# Altium schematic sheet STM32_Schematic.SchDoc
size A3; SheetNumber: 1; SheetTotal: 1
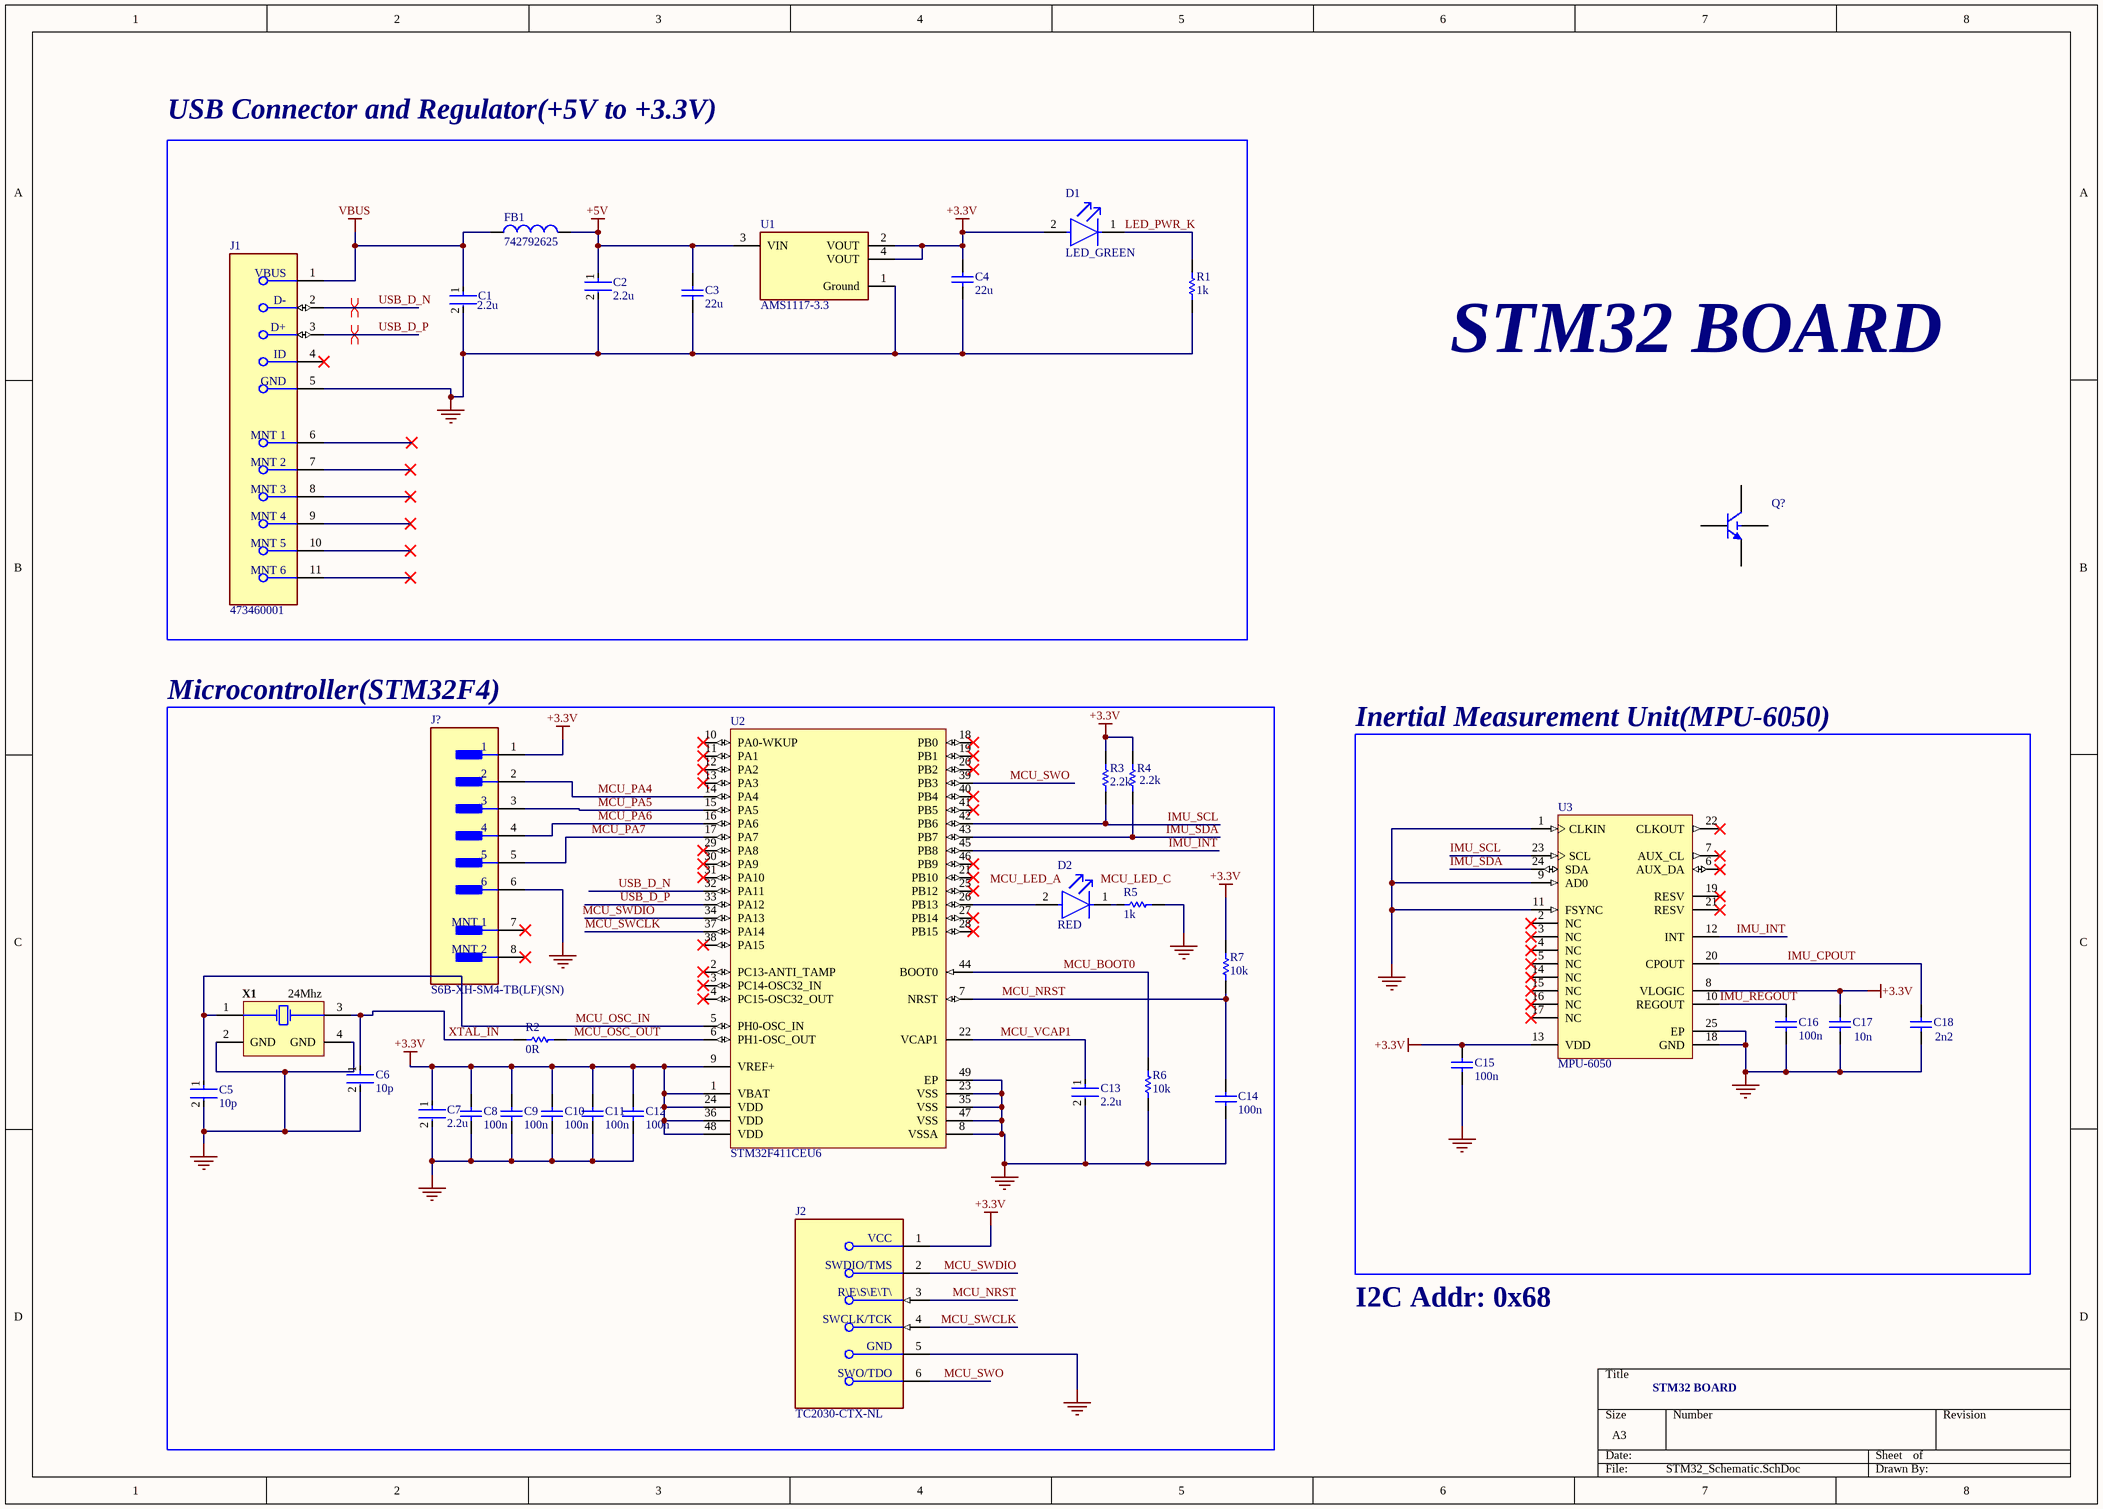
[diagram p0: STM32_Schematic.SchDoc]

## Parts
C1  2.2u  [FP-C0603C225K4PACTU-MFG]
C2  2.2u  [FP-C0603C225K4PACTU-MFG]
C3  22u  [CAPC2013X140X50ML20T25]
C4  22u  [CAPC2013X140X50ML20T25]
C5  10p  [FP-C0402-BB-MFG]
C6  10p  [FP-C0402-BB-MFG]
C7  2.2u  [FP-C0603C225K4PACTU-MFG]
C8  100n  [CAPC1005X55X30LL05T10]
C9  100n  [CAPC1005X55X30LL05T10]
C10  100n  [CAPC1005X55X30LL05T10]
C11  100n  [CAPC1005X55X30LL05T10]
C12  100n  [CAPC1005X55X30LL05T10]
C13  2.2u  [FP-C0603C225K4PACTU-MFG]
C14  100n  [CAPC1005X55X30LL05T10]
C15  100n  [CAPC1005X55X30LL05T10]
C16  100n  [CAPC1005X55X30LL05T10]
C17  10n  [CAPC1005X55X30LL05T10]
C18  2n2  [CAPC1005X55X30LL05T10]
D1  LED_GREEN  [FP-APHHS1005CGCK-MFG]
D2  RED  [FP-SML-P11UTT86-MFG]
FB1  742792625  [WE-CBF_0603_L1.6W0.8H0.8_HC]
J1  473460001  [FP-473460001-MFG]
J2  TC2030-CTX-NL  [FP-TC2030-CTX-NL-MFG]
J?  S6B-XH-SM4-TB(LF)(SN)  [FP-S6B-XH-SM4-TB_LF_SN-MFG]
Q?  Bipolar NPN 4 Pins Transistor Gummel-Poon Model  (value not drawn)
R1  1k  [RESC1005X40X25ML10T10]
R2  0R  [RESC1005X40X25LL10T10]
R3  2.2k  [RESC1005X40X25LL05T05]
R4  2.2k  [RESC1005X40X25LL05T05]
R5  1k  [RESC1005X40X25ML10T10]
R6  10k  [RESC1005X40X25NL10T10]
R7  10k  [RESC1005X40X25NL10T10]
U1  AMS1117-3.3  [FP-AMS1117-IPC_C]
U2  STM32F411CEU6  [STM-UFQFPN48_L]
U3  MPU-6050  [IS-QFN-24_V]
X1  24Mhz  [EPSON-TSX-3225_V]

## Blocks framed on the sheet
USB Connector and Regulator(+5V to +3.3V): C1-C4 D1 FB1 J1 R1 U1
Microcontroller(STM32F4): C5-C14 D2 J2 J? R2-R7 U2 X1
Inertial Measurement Unit(MPU-6050): C15-C18 U3

## Nets
+3.3V: C4.2 C7.1 C8.2 C9.2 C10.2 C11.2 C12.2 C15.2 C17.2 D1.2(A) J2.1(VCC) J?.1 R3.2 R4.2 R7.2 U1.2(VOUT) U1.4(VOUT) U2.1(VBAT) U2.9(VREF+) U2.24(VDD) U2.36(VDD) U2.48(VDD) U3.8(VLOGIC) U3.13(VDD)
+5V: C2.1 C3.2 FB1.2 U1.3(VIN)
GND: C1.2 C2.2 C3.1 C4.1 C5.2 C6.2 C7.2 C8.1 C9.1 C10.1 C11.1 C12.1 C13.2 C14.1 C15.1 C16.1 C17.1 C18.1 J1.5(GND) J2.5(GND) J?.6 R1.1 R5.1 R6.1 U1.1(Ground) U2.8(VSSA) U2.23(VSS) U2.35(VSS) U2.47(VSS) U2.49(EP) U3.1(CLKIN) U3.9(AD0) U3.11(FSYNC) U3.18(GND) U3.25(EP) X1.2(GND) X1.4(GND)
VBUS: C1.1 FB1.1 J1.1(VBUS)
IMU_CPOUT: C18.2 U3.20(CPOUT)
IMU_INT: U2.45(PB8) U3.12(INT)
IMU_REGOUT: C16.2 U3.10(REGOUT)
IMU_SCL: R3.1 U2.42(PB6) U3.23(SCL)
IMU_SDA: R4.1 U2.43(PB7) U3.24(SDA)
LED_PWR_K: D1.1(C) R1.2
MCU_NRST: C14.2 J2.3(~{RESET}) R7.1 U2.7(NRST)
MCU_OSC_IN: C5.1 U2.5(PH0-OSC_IN) X1.1(X1)
MCU_OSC_OUT: R2.2 U2.6(PH1-OSC_OUT)
MCU_PA4: J?.2 U2.14(PA4)
MCU_PA5: J?.3 U2.15(PA5)
MCU_PA6: J?.4 U2.16(PA6)
MCU_PA7: J?.5 U2.17(PA7)
MCU_SWCLK: J2.4(SWCLK/TCK) U2.37(PA14)
MCU_SWDIO: J2.2(SWDIO/TMS) U2.34(PA13)
MCU_SWO: J2.6(SWO/TDO) U2.39(PB3)
MCU_VCAP1: C13.1 U2.22(VCAP1)
USB_D_N: J1.2(D-) U2.32(PA11)
USB_D_P: J1.3(D+) U2.33(PA12)
XTAL_IN: C6.1 R2.1 X1.3(X2)
NetD2_1: D2.1(C) R5.2
NetD2_2: D2.2(A) U2.26(PB13)
NetR6_2: R6.2 U2.44(BOOT0)

Not connected (* = marked no-connect by the designer): J1 4(ID)* 6(MNT_1)* 7(MNT_2)* 8(MNT_3)* 9(MNT_4)* 10(MNT_5)* 11(MNT_6)*; J? 7(MNT_1)* 8(MNT_2)*; Q? 1(C) 2(B) 3(E) 4(S); U2 2(PC13-ANTI_TAMP)* 3(PC14-OSC32_IN)* 4(PC15-OSC32_OUT)* 10(PA0-WKUP)* 11(PA1)* 12(PA2)* 13(PA3)* 18(PB0)* 19(PB1)* 20(PB2)* 21(PB10)* 25(PB12)* 27(PB14)* 28(PB15)* 29(PA8)* 30(PA9)* 31(PA10)* 38(PA15)* 40(PB4)* 41(PB5)* 46(PB9)*; U3 2(NC)* 3(NC)* 4(NC)* 5(NC)* 6(AUX_DA)* 7(AUX_CL)* 14(NC)* 15(NC)* 16(NC)* 17(NC)* 19(RESV)* 21(RESV)* 22(CLKOUT)*

## Layout directives
differential pair; differential pair class DIFF_USB: USB_D_N, USB_D_P

## Notes on the sheet
- STM32 BOARD
- I2C Addr: 0x68
- Labels drawn without touching a wire or pin: MCU_BOOT0, MCU_LED_A, MCU_LED_C

## Library data of the parts
C1 C2 C7 C13 = CMP-2006-02259-2: CAP CER 2.2UF 16V X5R 0603; Dielectric Material: Ceramic; Tolerance: 10%; Dissipation Factor: 5%; Series: C; Voltage Rating (DC): 16V; REACH SVHC: No SVHC; RoHS Compliant: Yes; Number of Pins: 2; Max Operating Temperature: 85°C; Voltage Rating: 16V; Min Operating Temperature: -55°C; Termination: SMD/SMT; Dielectric: X5R; Packaging: Tape and Reel; Contact Plating: Tin; Case Code (Metric): 1608; Height: 0.8mm; Capacitance: 2.2uF; Case/Package: 0603; Width: 0.8mm; Construction: Flat; Depth: 0.8mm; Thickness: 0.034inch; Radiation Hardening: No; Length: 1.6mm; Mount: Surface Mount; Case Code (Imperial): 0603; Voltage: 16V; Package Quantity: 1; Lead Free: Lead Free
C3 C4 = CMP-2007-03313-1: Part Number: C0805X225K4RACTU; Manufacturer: Kemet
C5 C6 = CMP-2008-03443-2: CAP CER 10PF 16V 10% NP0 0402; Manufacturer Part Number: C0402C100K4GACTU; Manufacturer: Kemet; Material: Ceramic; Temperature Characteristic: C0G; Temperature Coefficient: 15%; Tolerance: 0.1; Device Class L2: Capacitors; Temperature Range High: +125°C; Device Class L3: Ceramic Capacitors; Height: 0.55mm; Mouser Description: Multilayer Ceramic Capacitors MLCC - SMD/SMT 16volts 10pF C0G 10%; Temperature Range Low: -55°C; Digikey Description: CAP CER 10PF 16V 10% NP0 0402; Device Class L1: Passive Components; ComponentLink2URL: https://content.kemet.com/datasheets/KEM_C1002_X7R_SMD.pdf; Package: C0402-BB; Automotive: No; Ipc Land Pattern Name: CAPC10050X50; Voltage Rating: 16 V; Category: Cap; Lead Free: Yes; RoHS: TRUE; Temperature: -55°C to +125°C; Capacitance: 10 pF; Value: 10 pF; ComponentLink2Description: Datasheet; Octopart: https://octopart.com/c0402c100k4gactu-kemet-12569135
C8-C12 C14-C18 = CMP-0001-00074-2: Manufacturer: Kemet; Part Number: C0402C104K4RACTU
D1 = CMP-44529-000044-1: LED GREEN CLEAR CHIP SMD; Viewing Angle: 120°; Dominant Wavelength: 570nm; Test Current: 20mA; Luminous Intensity: 50mcd; Forward Voltage: 2.1V; Number of LEDs: 1; Lens Color: Clear; Packaging: Tape and Reel; Max Operating Temperature: 85°C; Illumination Color: Green; Length: 1mm; Mount: Surface Mount; Lens Style: Clear; Color: Green; Number of Pins: 2; Wavelength: 570nm; Case/Package: 0402; Width: 0.5mm; Package Quantity: 2000; Case Code (Metric): 1005; Height: 0.6mm; Lead Free: Lead Free; Case Code (Imperial): 0402; Forward Current: 20mA; Min Operating Temperature: -40°C
D2 = CMP-08952-000028-1: LED RED CLEAR 1006 SMD; Number of LEDs: 1; Lens Color: Colorless; Viewing Angle: 150°; Dominant Wavelength: 621nm; Luminous Intensity: 5.5mcd; Forward Voltage: 1.8V; Lens Style: Square; Test Current: 1mA; Forward Current: 20mA; Height: 0.25mm; Radiation Hardening: No; Color: Red; Case Code (Metric): 1005; Number of Pins: 2; RoHS Compliant: Yes; Max Operating Temperature: 85°C; Package Quantity: 1; Wavelength: 621nm; Lens Transparency: Clear; Packaging: Tape and Reel; Lead Free: Lead Free; Illumination Color: Red; Case/Package: 0402; Case Code (Imperial): 0402; Mount: Surface Mount; Min Operating Temperature: -40°C; Width: 0.6mm; Length: 1mm; Series: PicoLED™; REACH SVHC: No SVHC
FB1 = CMP-0220-00174-3: NexarPartId: 30515504; Series Resistance: 50mΩ; Number of Lines: 1; Max Current Rating: 2A; Current Rating: 1.5A; Tolerance: 25%; Impedance: 120Ω; Test Frequency: 400MHz; Mount: Surface Mount; Weight: 2.012816mg; Case Code (Imperial): 0603; Termination: SMD/SMT; RMS Current (Irms): 2A; Width: 800µm; Min Operating Temperature: -55°C; Max Operating Temperature: 125°C; DC Resistance (DCR): 50mΩ; Packaging: Digi-Reel®; Case Code (Metric): 1608; Length: 1.6mm; Case/Package: 0603; Material: Ferrite; RoHS: Compliant; Core Material: Ferrite; Height: 800µm; Max DC Current: 2A; Depth: 800µm
J1 = CMP-2000-05246-2: CONN RCPT USB2.0 MICRO B SMD R/A; Manufacturer: Molex; Conn Orientation: Right Angle; Is Female: yes; Shielding: true; Pitch: 0.65mm; Number Of Contacts: 5; Voltage Rating: 30V; Current Rating: 1.8A; Device Class L2: USB Connectors; Digikey Description: CONN RCPT USB2.0 MICRO B SMD R/A; Height: 2.945mm; RoHS: TRUE; ComponentLink2Description: Datasheet; Octopart: https://octopart.com/47346-0001-molex-7164928; Automotive: No; Package: 0; Category: Conn; Device Class L1: Connectors; Usb Standard: USB 2.0; Temperature: -30°C to +85°C; Temperature Range Low: -30°C; Footprint Url: https://www.molex.com/pdm_docs/sd/473460001_sd.pdf; ComponentLink2URL: https://www.molex.com/webdocs/datasheets/pdf/en-us/0473460001_IO_CONNECTORS.pdf; Lead Free: Yes; Manufacturer Part Number: 473460001; Contact Material: Gold,Nickel; Temperature Range High: +85°C; Device Class L3: unset
J2 = CMP-205963-000001-1: 6-Pin “No legs” TC2030 Plug-of-Nails™ Cable for use with ARM Cortex processors
J? = CMP-17439-000164-1: CONN HEADER SMD R/A 6POS 2.5MM; Gender: Male; Number of Positions: 6; Max Current Rating: 3A; Voltage Rating: 250V; Contact Resistance: 20mR; Flammability Rating: UL94 V-0; Orientation: Right Angle; Contact Finish - Mating: TIN; Packaging: Tape and Reel; Termination: Solder; Pitch: 2.5mm; Housing Color: Beige; Insulation Material: Nylon; Fastening Type: Detent; Housing Material: Polyamide; Package Quantity: 1; Mount: Surface Mount; Insulation Color: Natural; Series: XH; Depth: 7mm; Contact Shape: Square; Color: Natural; Max Voltage Rating (AC): 250V; Min Operating Temperature: -25°C; Number of Contacts: 6; Lead Free: Lead Free; Contact Material: Copper Alloy; Contact Type: Male Pin; Length: 20mm; Max Operating Temperature: 85°C; Connector Type: Header; Number of Rows: 1; REACH SVHC: No SVHC; Contact Plating: Copper
Q? = BJT NPN 4 GP: SimulationGenericComponent: True; BF: 100; AF: 0; BR: 1; EG: 1.11; FC: 0.5; IS: 1e-16; MJC: 0.33; NC: 2; NE: 1.5; TNOM: 27; VBC_MAX: 1e99; VJC: 0.75; XTI: 3; CJC: 0; CJE: 0; CJS: 0; CTC: 0; CTE: 0; CTS: 0; IKF: 0; IKR: 0; IRB: 0; ISC: 0; ISE: 0; ISS: 0; ITF: 0; KF: 0; MJE: 0.33; MJS: 0; NF: 1; NKF: 0.5; NR: 1; NS: 1; PTF: 0; RB: 0; RBM: 0; RC: 0; RE: 0; SUBS: 1; TBF1: 0; TBF2: 0; TBR1: 0; TBR2: 0; TF: 0; TIKF1: 0; TIKF2: 0; TIKR1: 0; TIKR2: 0; TIRB1: 0; TIRB2: 0; TIS1: 0; TIS2: 0; TISC1: 0; TISC2: 0; TISE1: 0; TISE2: 0; TITF1: 0; TITF2: 0; TLEV: 0; TLEVC: 0; TMJC1: 0; TMJC2: 0; TMJE1: 0; TMJE2: 0; TMJS1: 0; TMJS2: 0; TNC1: 0; TNC2: 0; TNE1: 0; TNE2: 0; TNF1: 0; TNF2: 0; TNR1: 0; TNR2: 0; TNS1: 0; TNS2: 0; TR: 0; TRB1: 0; TRB2: 0; TRC1: 0; TRC2: 0; TRE1: 0; TRE2: 0; TRM1: 0; TRM2: 0; TTF1: 0; TTF2: 0; TTR1: 0; TTR2: 0; TVAF1: 0; TVAF2: 0; TVAR1: 0; TVAR2: 0; TVJC: 0; TVJE: 0; TVJS: 0; VAF: 0; VAR: 0; VBE_MAX: 1e99; VCE_MAX: 1e99; VJE: 0.75; VJS: 0.75; VTF: 0; XCJC: 1; XTB: 0; XTF: 0
R1 R5 = CMP-2002-04691-1: Part Number: CR0402-FX-1001G; Manufacturer: Bourns
R2 = CMP-2002-04690-1: Manufacturer: Bourns; Part Number: CR0402-FX-1000GLF
R3 R4 = CMP-2002-00488-1: Part Number: ERJ-2GEJ222X; Manufacturer: Panasonic
R6 R7 = CMP-2002-04694-1: Manufacturer: Bourns; Part Number: CR0402-FX-1002GLF
U1 = CMP-209535-000001-1: LDO Voltage Regulators 1A, 3.3V; Manufacturer: Advanced Monolithic Systems; Dropout Voltage: 1.1V; Output Type: Fixed; Nominal Supply Current: 5mA; Max Power Dissipation: 1.2W; Max Supply Voltage: 15V; Number Of Outputs: 1; Standoff Height: 0.64mm; Max Junction Temp: +125°C; Height: 1.8mm; Package: AMS1117; Device Class L2: Power Management ICs; ComponentLink2Description: Datasheet; ComponentLink2URL: http://www.advanced-monolithic.com/pdf/ds1117.pdf; Category: IC; RoHS: TRUE; Automotive: No; Device Class L1: Integrated Circuits (ICs); Output Current: 1A; Device Class L3: Voltage Regulators - Linear; Temperature: -40°C to +125°C; Output Voltage: 3.3V; Manufacturer Part Number: AMS1117-3.3; Temperature Range Low: -40°C; Octopart: https://octopart.com/ams1117-3.3-advanced+monolithic+systems-25899300; Lead Free: Yes; Ipc Land Pattern Name: SOT229P700X180-4; Temperature Range High: +125°C
U2 = CMP-0243-00165-1: ARM Cortex-M4 32-bit MCU+FPU, 512 KB Flash, 128 KB RAM, 36 I/Os, 48-Pin UFQFPN, -40 to 85 degC, Tray; Operating Frequency(F) (Processor speed) (MHz): 100; FLASH Size (Prog) (kB): 512; Internal RAM Size (kB): 128; I/Os (High Current): 36; Supply Voltage(Vcc) min (V): 1.7; Package Reference: 48-Pin Ultra Thin Fine Pitch Quad Flat No-Lead, 7 x 7 x 0.6 mm Body, 0.5 mm Pitch, Exposed Pad; ComponentLink1Description: Manufacturer URL; ComponentLink1URL: http://www.st.com/; Packing: Tray; Package Description: UFQFPN48; Core: ARM Cortex-M4; ComponentLink2Description: Datasheet; ComponentLink2URL: http://www.st.com/st-web-ui/static/active/en/resource/technical/document/datasheet/DM00115249.pdf; DatasheetVersion: Rev. 6; Mounting Technology: Surface Mount
U3 = CMP-1753-00002-2: 3-Axis Gyroscope, Accelerometer and a Digital Motion Processor(TM) (DMP), 2.375 to 3.46 V, -40 to 85 degC, 24-Pin QFN, RoHS, Tape and Reel; Manufacturer: InvenSense; Featured Product: MPU-60506-Axis,IntegratedI²CSolution; Other Names: 1428-1007-2 / MPU6050; Sensor Type: MotionTracking; Online Catalog: MPU-6000™Series; Unit PriceUSD: Digital; Datasheet Version: Rev. 3.3, 05/2012; Category: Sensors,Transducers; Datasheet URL: http://datasheet.octopart.com/MPU-6050-InvenSense-datasheet-14421344.pdf; Family: Multifunction; Standard Package: 5,000; Manufacturer URL: http://www.invensense.com/; Output Type: Digital; Dynamic Catalog: MPU-6000™Series
X1 = CMP-2000-07333-1: MHz Range Crystal, 24 MHz, -40 to 85 degC, 4-Pin SMD, RoHS, Tape and Reel; Manufacturer: Epson; Brand: EpsonTiming; Frequency Stability: 10PPM; ESR: 40Ohms; Load Capacitance: 9pF; Unit Weight: 0.000564oz; Drive Level: 200uW; Datasheet Version: 12/2015; RoHS: True; Operating Temperature Range: -40Cto+85C; Length: 3.2mm; Tolerance: 10PPM; Width: 2.5mm; Mounting Technology: SurfaceMount; Package Description: 4-Pin Surface Mount Device, Body 3.2 x 2.5 mm; Frequency: 24MHz; Manufacturer URL: https://www.eea.epson.com/; Factory Pack Quantity: 250; Package Reference: TSX-3225; Height: 0.6mm; Mounting Style: SMD/SMT; Termination Style: SMD/SMT; Datasheet URL: https://support.epson.biz/td/api/doc_check.php?dl=brief_FA-238V_en.pdf; Type: Crystal; Series: TSX-3225; Package / Case: 3.2mmx2.5mm; Product Category: Crystals; Packaging: Reel